# EasyEDA Pro project SimGEKI2_Switches.epro

# Schematic Switch_1
Create Date: 2024-01-29; Page Name: P1; Project Name: ongeki-controller; Schematic Name: Switch_1; Update Date: 2024-07-05
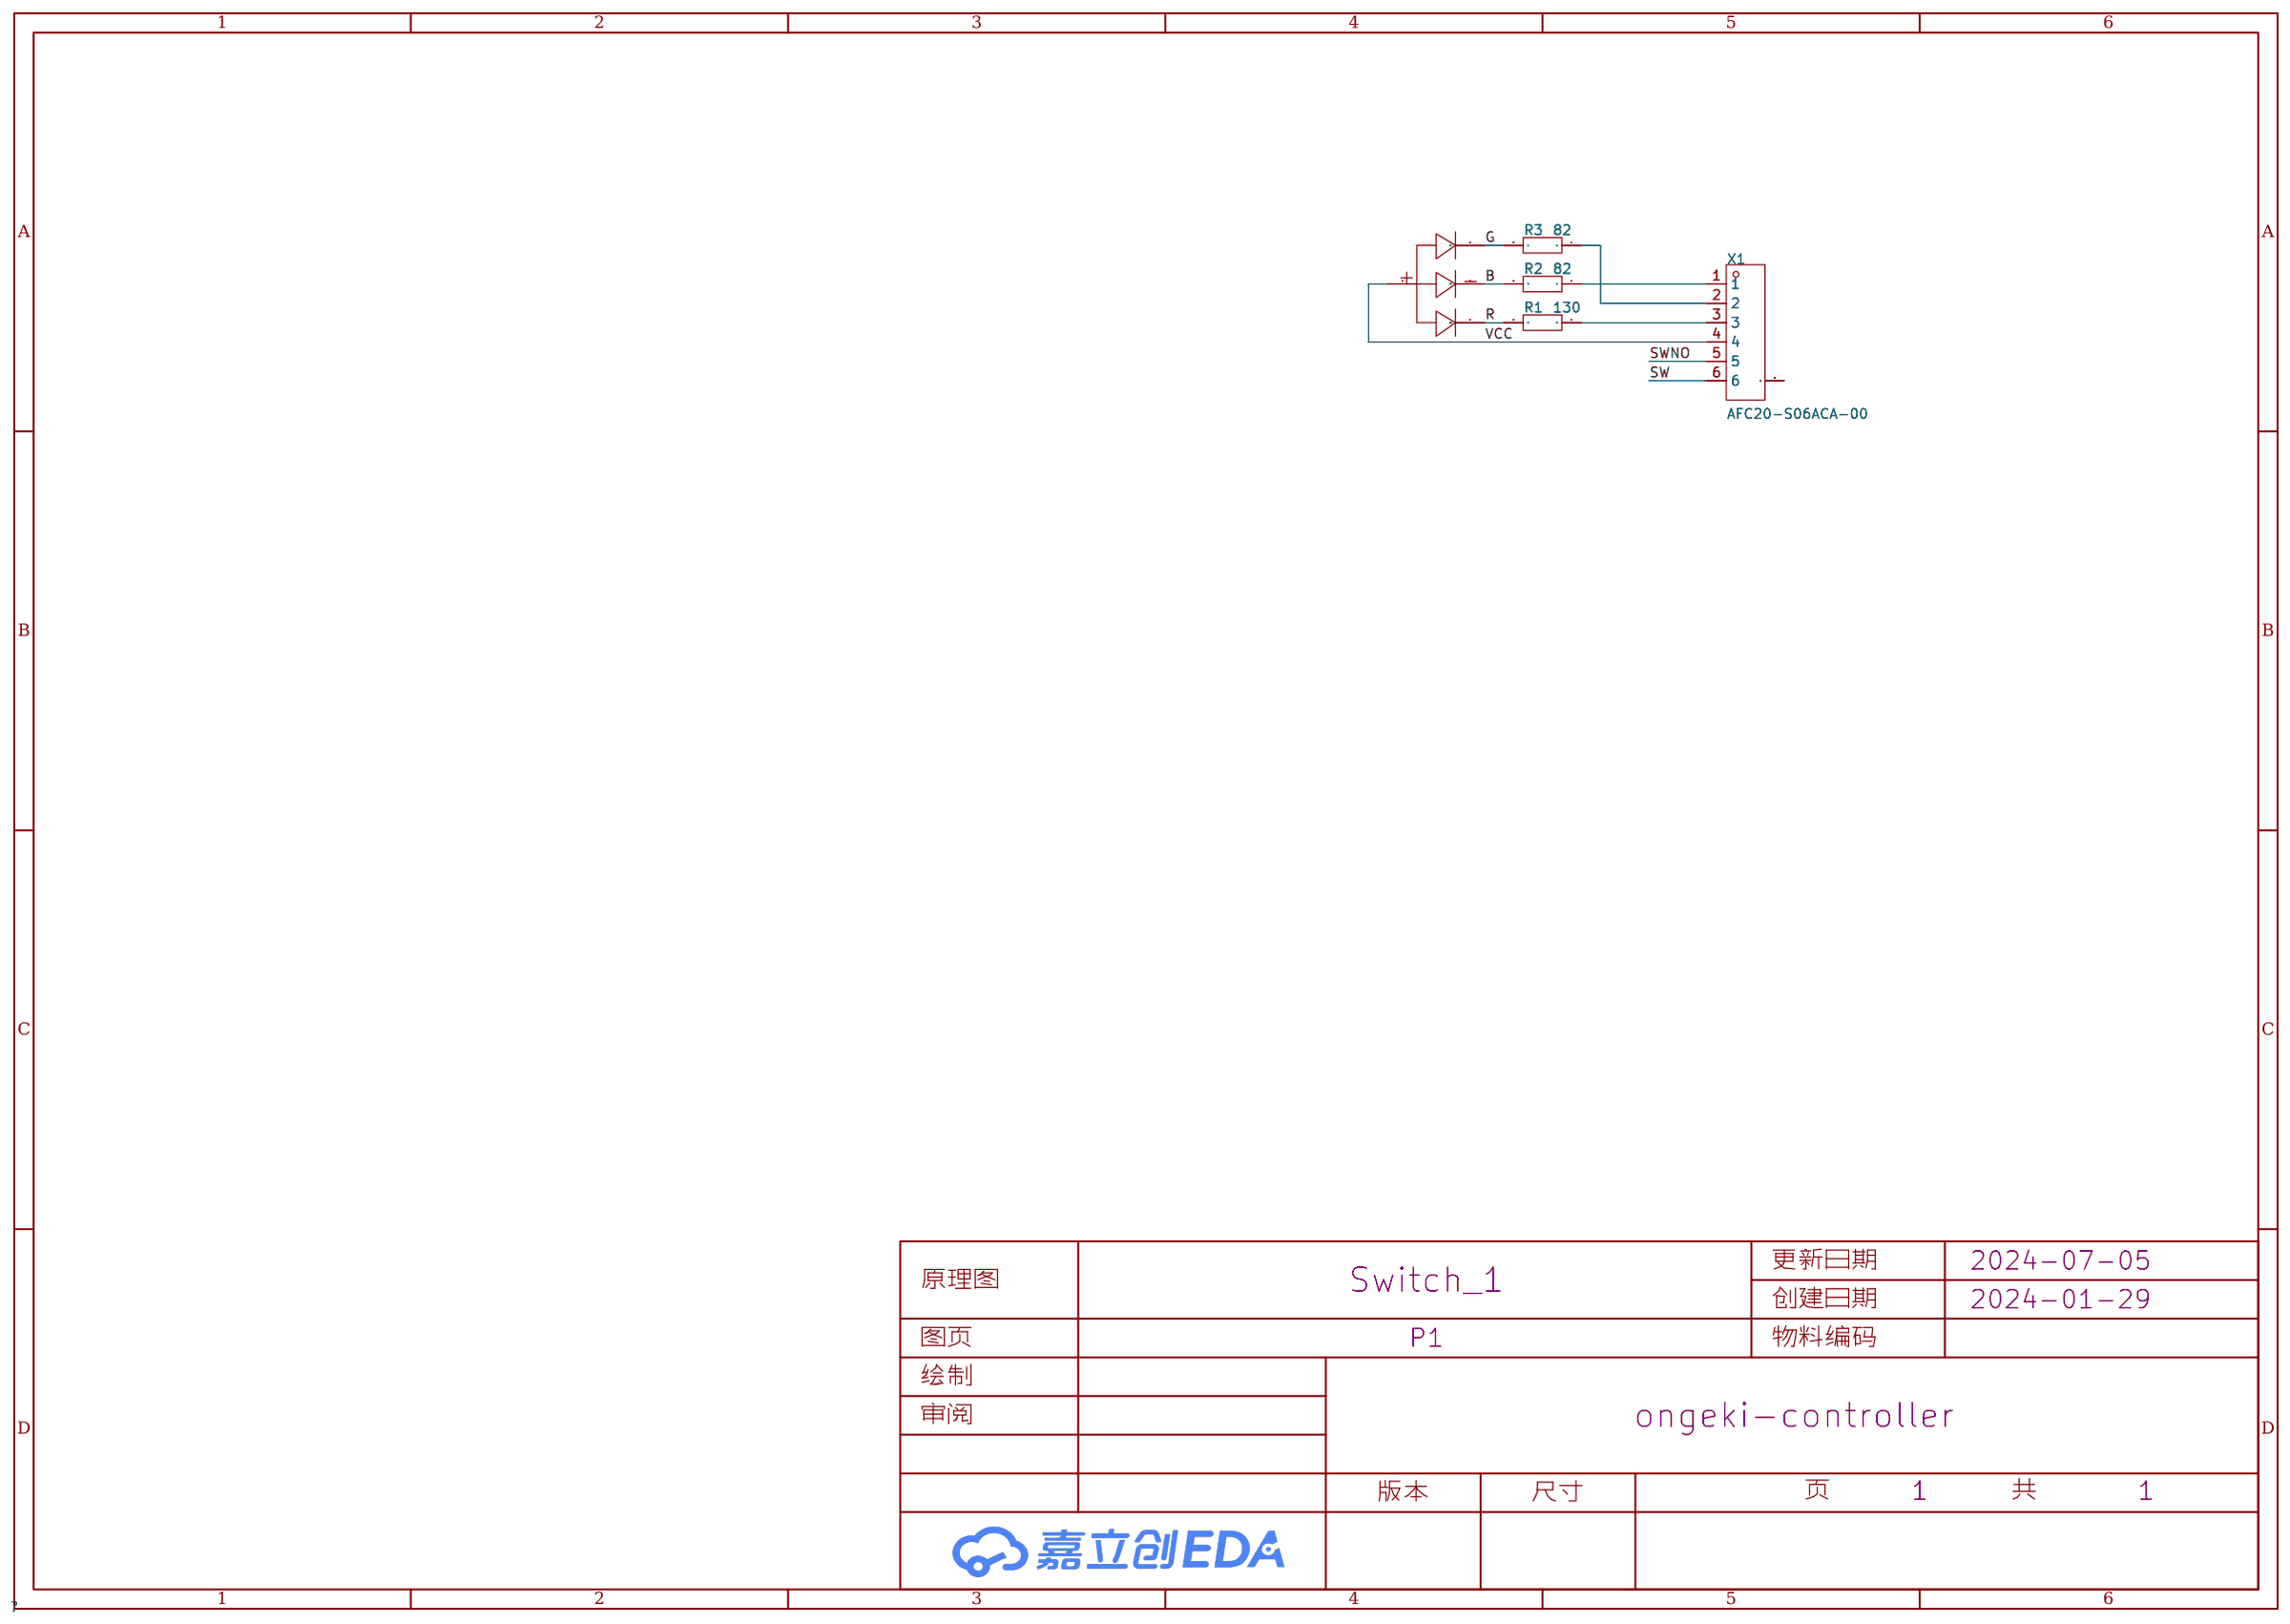
[diagram p0: schematic sheet]

## Parts
LED  -  [LED-SMD_4P-L4.0-W1.7-P0.84_C9900049198]
R1  130  [R0603]
R2  82  [R0603]
R3  82  [R0603]
X1  AFC20-S06ACA-00  [CONN-SMD_6P-P2.00-H-AFC20-S06ACA-00]

## Library data of the parts
LED = 4020侧贴共阳RGB
R1-R3 = Res_0603: Supplier Footprint: 0603
X1 = AFC20-S06ACA-00: 插针结构:1x6P;间距:2mm;公母:公;安装方式:卧贴;行距:-;排数:1;每排PIN数:6;参考系列:PH;额定电流:2A;工作温度范围:-20℃~+85℃;; LCSC Part Name: 1x6P 间距:2mm 卧贴 系列:PH; Supplier Part: C2764215; Manufacturer: JS(钜硕电子); Supplier Footprint: SMD,P=2mm; JLCPCB Part Class: Extended Part; Datasheet: https://atta.szlcsc.com/upload/public/pdf/source/20210330/C2764211_02EB64B884E80A283E97197BD72D19B1.pdf; Supplier: LCSC; Pins Structure: 1x6P; Pitch: 2mm; Gender: 公; Mounting Style: 卧贴; Number of Rows: 1; Number of PINs Per Row: 6; Reference Series: PH; Current Rating (Max): 2A; Operating Temperature Range: -20℃~+85℃

## Nets
VCC: LED.3(A) X1.4
B: LED.2(C2) R2.2
G: LED.1(C1) R3.2
R: LED.4(C3) R1.2
SW: X1.6
SWNO: X1.5
$1N1081: R1.1 X1.3
$1N1272: R3.1 X1.2
$1N1277: R2.1 X1.1

Not connected (* = marked no-connect by the designer): X1 0

# Board Switch_1
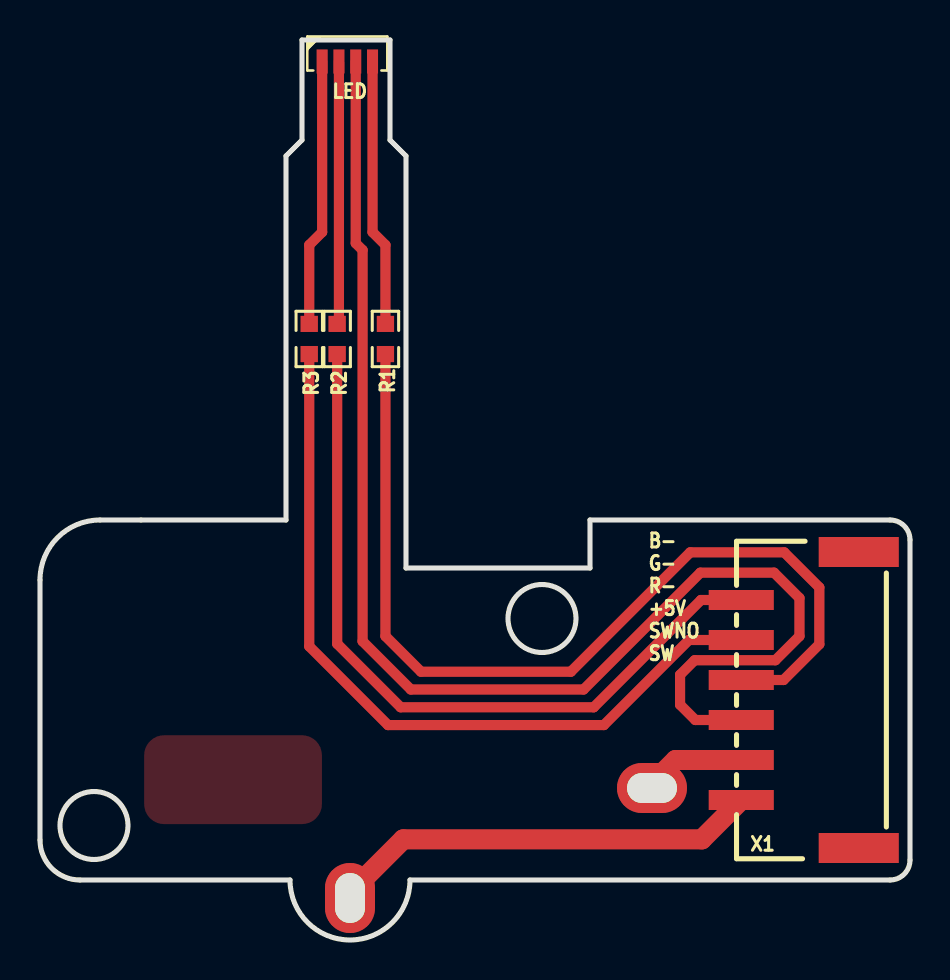
[diagram p1: board, top side]
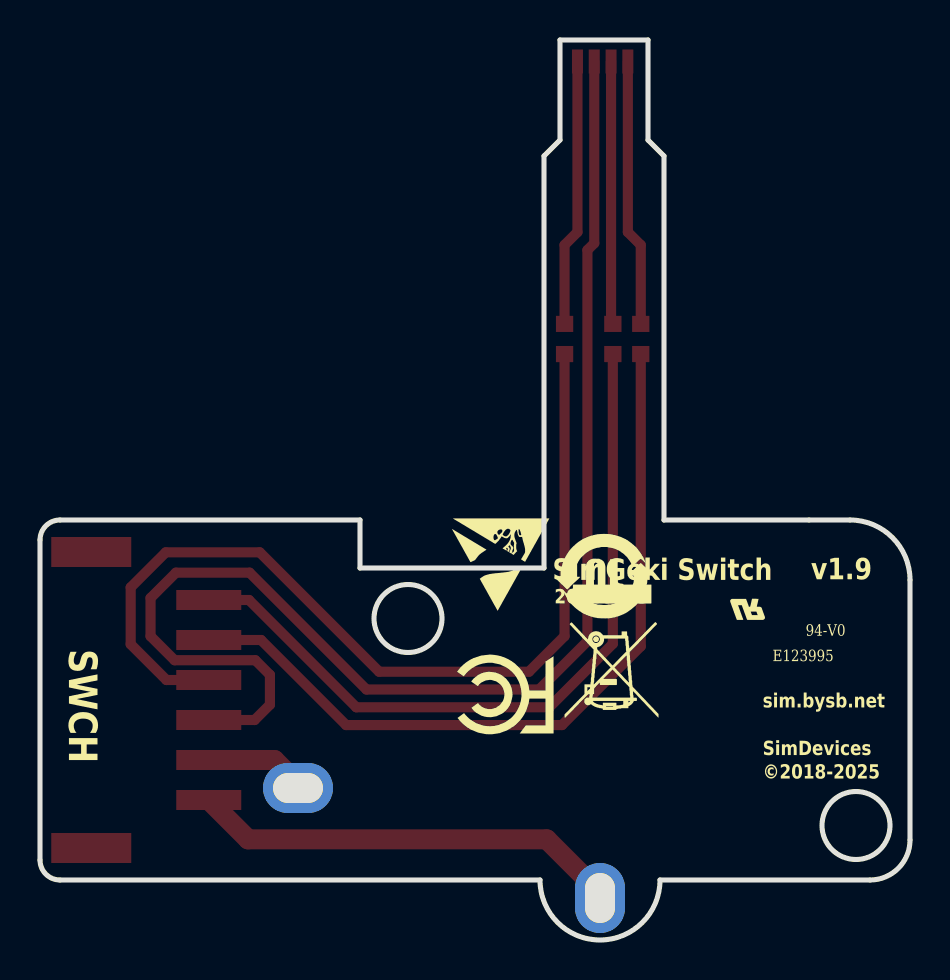
[diagram p2: board, bottom side, seen from below]

Outline 43.5 x 45 mm; copper layers: Top Layer, Bottom Layer. Coordinates in mm from the lower left corner of the outline.
Outline path: circle c2.7,5.72 r1.7 ; circle c25.1,16.08 r1.7 ; 0,18 arc(0.88,20.12) 3,21 12.3,21 12.3,39.2 13.1,40 13.1,45 17.5,45 17.5,40 18.3,39.2 18.3,18.6 27.5,18.6 27.5,21 42.5,21 arc(43.21,20.71) 43.5,20 43.5,4 arc(43.21,3.29) 42.5,3 18.5,3 arc(15.5,0) 12.5,3 2,3 arc(0.59,3.59) 0,5 0,18
Stack: Top Layer 0.035mm / Dielectric1 1.51mm FR4 er 4.5 / Bottom Layer 0.035mm

## Design rules (mm)
template: JLCPCB Capability(Two Layers Board)
spacing copperThickness1oz (default): track to track 0.102, other pairs 0.152 to 0.3
spacing copperThickness2oz: track to track 0.203, other pairs 0.152 to 0.3
track width copperThickness1oz (default): min 0.127, default 0.254, max 2.54
track width copperThickness2oz: min 0.203, default 0.254, max 2.54
differential pair differentialPair (default): width min 0.127, default 0.254, max 2.54; gap min 0.152, default 0.152
via viaSize (default): diameter min 0.5, default 0.61, max 10; hole min 0.3, default 0.305, max 6.3

## Placement (name value [footprint] x y rotation side)
LED  -  [LED-SMD_4P-L4.0-W1.7-P0.84_C9900049198]  15.37 43.92 0 top
NOREF  -  [Pad_e94]  30.6 7.6 0 top
NOREF#2  -  [Pad_e118]  15.5 2.1 0 top
R1  130  [R0603]  17.27 30.05 90 top
R2  82  [R0603]  14.86 30.05 90 top
R3  82  [R0603]  13.46 30.05 90 top
X1  AFC20-S06ACA-00  [CONN-SMD_6P-P2.00-H-AFC20-S06ACA-00]  38 12 90 top

## Footprints (pads in the part's own frame, mm; a bottom-side part is the same pattern mirrored in y, then rotated)
CONN-SMD_6P-P2.00-H-AFC20-S06ACA-00
  rect 1.5x4 smd: 0(-7.4,-2.938) 0(7.4,-2.938)
  rect 1x3.25 smd: 1(5,2.938) 2(3,2.938) 3(1,2.938) 4(-1,2.938) 5(-3,2.938) 6(-5,2.938)
LED-SMD_4P-L4.0-W1.7-P0.84_C9900049198
  rect 0.55x1.2 smd: 1(-1.26,0) 2(-0.42,0) 3(0.42,0) 4(1.26,0)
Pad_e94
  oval 3.5x2.5 hole 2.5x1.5: 7(0,0)
Pad_e118
  oval 2.5x3.5 hole 1.5x2.5: 7(0,0)
R0603
  rect 0.806x0.864 smd: 1(-0.753,0) 2(0.753,0)

## Nets
VCC: LED.3 X1.4
B: LED.2 R2.2
G: LED.1 R3.2
R: LED.4 R1.2
SW: NOREF#2.7 X1.6
SWNO: NOREF.7 X1.5
$1N1081: R1.1 X1.3
$1N1272: R3.1 X1.2
$1N1277: R2.1 X1.1

Pads without a net: X1 0

## Routing (per net, layer and track width the routed paths; a pad name or vN(x,y) marks a point on that pad's centre or on a via; arc(x,y) is an arc through that point)
VCC: length 68.5
  Top Layer w0.508: 15.79,43.92 15.79,34.84 16.13,34.5 16.13,14.94 18.54,12.53 27.18,12.53 33.02,18.37 36.7,18.37 37.97,17.1 37.97,15.19 36.77,13.99 32.73,13.99 32,13.26 32,11.76 32.77,11 X1.4
B: length 13.2
  Top Layer w0.508: LED.2 14.95,30.89 R2.2
G: length 13.4
  Top Layer w0.508: R3.2 13.46,34.75 14.11,35.39 LED.1
R: length 13.4
  Top Layer w0.508: R1.2 17.27,34.75 16.63,35.39 16.63,43.92
SW: length 22.1
  Top Layer w1: 15.5,1.8 15.5,2.37 18.16,5.03 33.09,5.03 X1.6
SWNO: length 5
  Top Layer w1: 30.6,7.8 30.6,7.82 31.78,9 X1.5
$1N1081: length 47.2
  Top Layer w0.508: R1.1 17.27,15.19 19.05,13.41 26.54,13.41 32.51,19.38 37.21,19.38 38.97,17.63 38.97,14.79 37.18,13 X1.3
$1N1272: length 39.6
  Top Layer w0.508: R3.1 13.46,14.68 17.4,10.75 28.19,10.75 32.45,15 X1.2
$1N1277: length 38.2
  Top Layer w0.508: R2.1 14.86,14.81 18.03,11.64 27.69,11.64 33.05,17 X1.1

## Copper pours and planes (outline as drawn; the poured copper is in the pictures)
(no net) on Top Layer: 5.21,10.24 14.1,10.24 14.1,5.79 5.21,5.79

## Text on the board
Bottom Silkscreen Layer: sim.bysb.net | SimDevices / ©2018-2025 | 20240705 | v1.9 | SimGeki Switch | SWCH | 94-V0 | E123995
Top Solder Mask Layer: SimGeki | Switch
Top Silkscreen Layer: B- / G- / R- / +5V / SWNO / SW | JLCJLCJLCJLC
